# Altium schematic sheet Top.SchDoc
size B; SheetNumber: 1; SheetTotal: 7
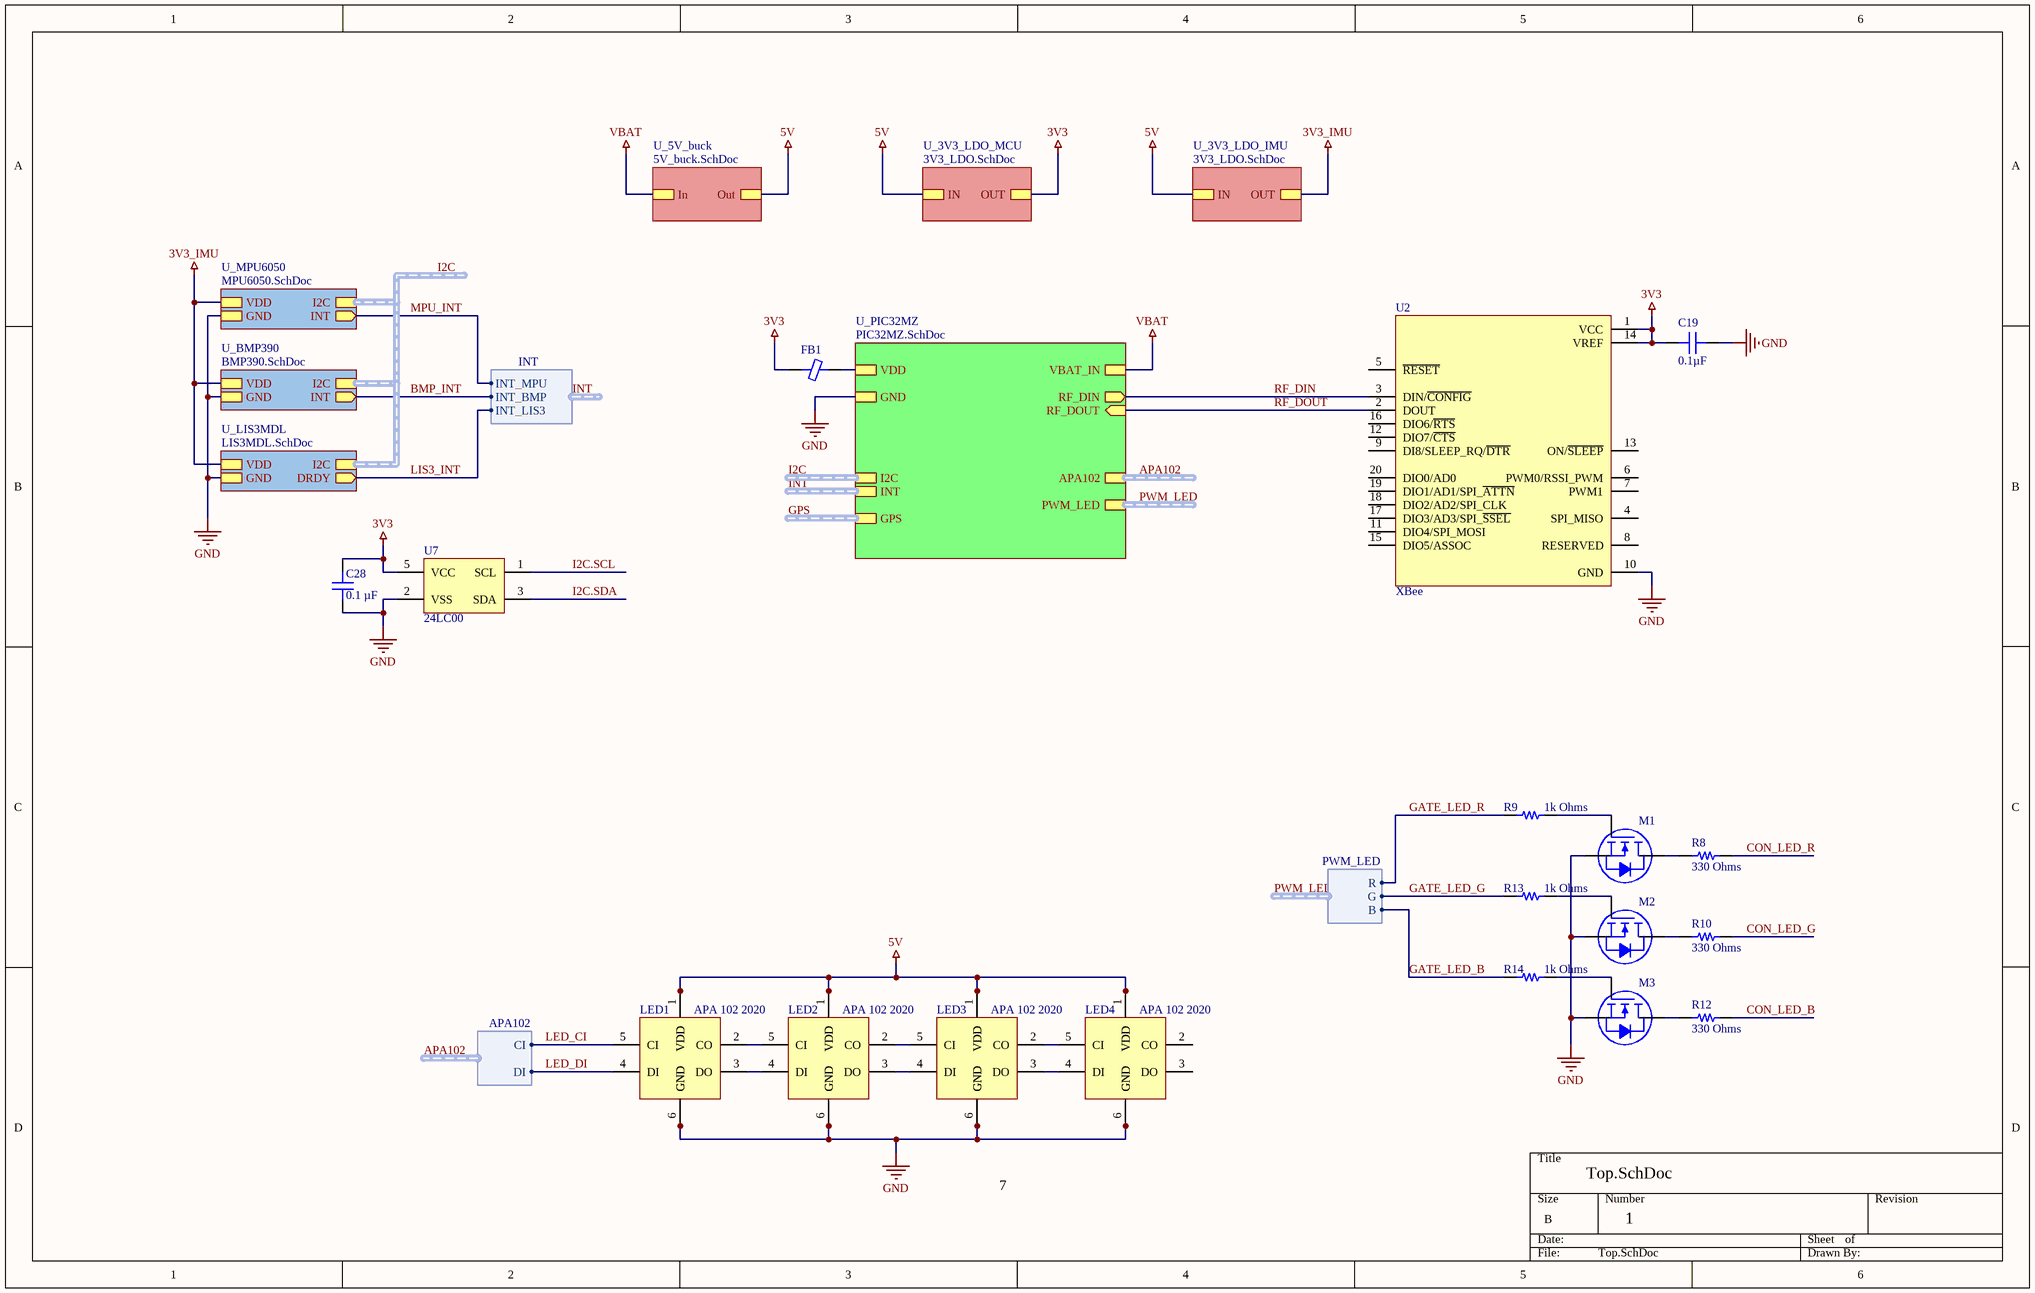
[diagram p0: Top.SchDoc]

## Parts
C19  0.1µF  [CAP 0603_1608]
C28  0.1 µF  [CAP 0402_1005]
FB1  (no value)  [FER 0805_2012]
LED1  APA 102 2020  [LED_APA-102-2020-256-8]
LED2  APA 102 2020  [LED_APA-102-2020-256-8]
LED3  APA 102 2020  [LED_APA-102-2020-256-8]
LED4  APA 102 2020  [LED_APA-102-2020-256-8]
M1  BSS123-7-F  [DIODES SOT-23-3]  (value not drawn)
M2  BSS123-7-F  [DIODES SOT-23-3]  (value not drawn)
M3  BSS123-7-F  [DIODES SOT-23-3]  (value not drawn)
R8  330 Ohms  [RES 0603_1608]
R9  1k Ohms  [RES 0402_1005]
R10  330 Ohms  [RES 0603_1608]
R12  330 Ohms  [RES 0603_1608]
R13  1k Ohms  [RES 0402_1005]
R14  1k Ohms  [RES 0402_1005]
U2  XBee  [XBee]
U7  24LC00  [SOT-23-5]

## Sub-sheets
U_3V3_LDO_IMU = 3V3_LDO.SchDoc: OUT, IN
U_3V3_LDO_MCU = 3V3_LDO.SchDoc: OUT, IN
U_5V_buck = 5V_buck.SchDoc: Out, In
U_BMP390 = BMP390.SchDoc: VDD, GND, I2C (harness I2C), INT (out)
U_LIS3MDL = LIS3MDL.SchDoc: VDD, GND, I2C (harness I2C), DRDY (out)
U_MPU6050 = MPU6050.SchDoc: VDD, GND, I2C (harness I2C), INT (out)
U_PIC32MZ = PIC32MZ.SchDoc: RF_DIN (out), RF_DOUT (in), GND, VDD, VBAT_IN, APA102 (harness APA102), I2C (harness I2C), GPS (harness GPS), PWM_LED (harness PWM_LED), INT (harness INT)

## Harnesses
APA102: DI, CI
PWM_LED: R, B, G
INT: INT_MPU, INT_BMP, INT_LIS3

## Nets
3V3: C19.1 C28.2 FB1.1 U2.1(VCC) U2.14(VREF) U7.5(VCC) ; sheet U_3V3_LDO_MCU/OUT
3V3_IMU: sheet U_3V3_LDO_IMU/OUT, sheet U_MPU6050/VDD, sheet U_BMP390/VDD, sheet U_LIS3MDL/VDD
5V: LED1.1(VDD) LED1.8(VDD) LED2.1(VDD) LED2.8(VDD) LED3.1(VDD) LED3.8(VDD) LED4.1(VDD) LED4.8(VDD) ; sheet U_3V3_LDO_MCU/IN, sheet U_3V3_LDO_IMU/IN, sheet U_5V_buck/Out
GND: C19.2 C28.1 LED1.6(GND) LED1.7(GND) LED2.6(GND) LED2.7(GND) LED3.6(GND) LED3.7(GND) LED4.6(GND) LED4.7(GND) M1.2(S) M2.2(S) M3.2(S) U2.10(GND) U7.2(VSS) ; sheet U_PIC32MZ/GND, sheet U_MPU6050/GND, sheet U_BMP390/GND, sheet U_LIS3MDL/GND
VBAT: sheet U_PIC32MZ/VBAT_IN, sheet U_5V_buck/In
BMP_INT: sheet U_BMP390/INT, sheet U_PIC32MZ/INT.INT_BMP
CON_LED_B: R12.2
CON_LED_G: R10.2
CON_LED_R: R8.2
GATE_LED_B: R14.2 ; sheet U_PIC32MZ/PWM_LED.B
GATE_LED_G: R13.2 ; sheet U_PIC32MZ/PWM_LED.G
GATE_LED_R: R9.2 ; sheet U_PIC32MZ/PWM_LED.R
I2C.SCL: U7.1(SCL)
I2C.SDA: U7.3(SDA)
LED_CI: LED1.5(CI) ; sheet U_PIC32MZ/APA102.CI  [project net APA102.CI]
LED_DI: LED1.4(DI) ; sheet U_PIC32MZ/APA102.DI  [project net APA102.DI]
LIS3_INT: sheet U_LIS3MDL/DRDY, sheet U_PIC32MZ/INT.INT_LIS3  [project net INT.INT_LIS3]
MPU_INT: sheet U_MPU6050/INT, sheet U_PIC32MZ/INT.INT_MPU  [project net INT.INT_MPU]
RF_DIN: U2.3(DIN/~{CONFIG}) ; sheet U_PIC32MZ/RF_DIN
RF_DOUT: U2.2(DOUT) ; sheet U_PIC32MZ/RF_DOUT
NetFB1_2: FB1.2 ; sheet U_PIC32MZ/VDD
NetLED1_2: LED1.2(CO) LED2.5(CI)
NetLED1_3: LED1.3(DO) LED2.4(DI)
NetLED2_2: LED2.2(CO) LED3.5(CI)
NetLED2_3: LED2.3(DO) LED3.4(DI)
NetLED3_2: LED3.2(CO) LED4.5(CI)
NetLED3_3: LED3.3(DO) LED4.4(DI)
NetM1_1: M1.1(G) R9.1
NetM1_3: M1.3(D) R8.1
NetM2_1: M2.1(G) R13.1
NetM2_3: M2.3(D) R10.1
NetM3_1: M3.1(G) R14.1
NetM3_3: M3.3(D) R12.1

Not connected (* = marked no-connect by the designer): LED4 2(CO) 3(DO); U2 4(SPI_MISO) 5(~{RESET}) 6(PWM0/RSSI_PWM) 7(PWM1) 8(RESERVED) 9(DI8/SLEEP_RQ/~{DTR}) 11(DIO4/SPI_MOSI) 12(DIO7/~{CTS}) 13(ON/~{SLEEP}) 15(DIO5/ASSOC) 16(DIO6/~{RTS}) 17(DIO3/AD3/SPI_~{SSEL}) 18(DIO2/AD2/SPI_CLK) 19(DIO1/AD1/SPI_~{ATTN}) 20(DIO0/AD0)

## Buses and harness runs
harness APA102 = sheet U_PIC32MZ/APA102
harness GPS = sheet U_PIC32MZ/GPS
harness I2C = sheet U_BMP390/I2C = sheet U_LIS3MDL/I2C = sheet U_MPU6050/I2C
harness I2C = sheet U_PIC32MZ/I2C
harness INT = sheet U_PIC32MZ/INT
harness PWM_LED = sheet U_PIC32MZ/PWM_LED

## Library data of the parts
C19 = LD035C104JAB2A: CAP CER 0.1UF 50V X7R 0603; manufacturer: AVX Corporation; Tolerance: ±5%; Part Number: LD035C104JAB2A; Value: 0.1µF; Applications: General Purpose; Capacitance: 0.1µF; componentlink1description: Datasheet; componentlink1url: http://datasheets.avx.com/LD-Series.pdf; componentlink2description: DigiKey Link; componentlink2url: http://digikey.com/product-detail/en/avx-corporation/LD035C104JAB2A/478-13106-1-ND/9948622; Device Package: 0603 (1608 Metric); lastupdated: 9/2/2020 1:03:21 AM; Lifecycle Status: Active; Minimum Order: 1; Mounting Type: Surface Mount, MLCC; Operating Temperature: -55°C ~ 125°C; Package / Case: 0603 (1608 Metric); packaging: TapeAndReel; partid: 10760; Part Status: Active; price: 0.23; series: LD; Size / Dimension: 0.063" L x 0.032" W (1.60mm x 0.81mm); Supplier 1: DigiKey; Supplier Part Number 1: 478-13106-1-ND; Temperature Coefficient: X7R; Thickness (Max): 0.035" (0.90mm); Voltage - Rated: 50V
C28 = C0402C104K4RACAUTO: CAP CER 0.1UF 16V X7R 0402; manufacturer: KEMET; Tolerance: ±10%; Part Number: C0402C104K4RACAUTO; Value: 0.1 µF; Applications: Automotive, Bypass, Decoupling; Capacitance: 0.1 µF; componentlink1description: Datasheet; componentlink1url: https://api.kemet.com/component-edge/download/specsheet/C0402C104K4RACAUTO.pdf; componentlink2description: DigiKey Link; componentlink2url: https://www.digikey.com/en/products/detail/kemet/C0402C104K4RACAUTO/3314827; Device Package: 0402 (1005 Metric); lastupdated: 8/14/2022 9:05:51 PM; Lifecycle Status: Active; Minimum Order: 1; Mounting Type: Surface Mount, MLCC; Operating Temperature: -55°C ~ 125°C; Package / Case: 0402 (1005 Metric); packaging: TapeAndReel; partid: 3024; Part Status: Active; price: 0.01; Ratings: AEC-Q200; series: SMD Auto X7R; Size / Dimension: 0.039" L x 0.020" W (1.00mm x 0.50mm); Supplier 1: DigiKey; Supplier Part Number 1: 399-6828-1-ND; Temperature Coefficient: X7R; Thickness (Max): 0.022" (0.55mm); Voltage - Rated: 16V
FB1 = 2508051017Y0: FERRITE BEAD 0805 1LN; Manufacturer: Fair-Rite Products Corp.; Current Rating (Max): 300mA; DC Resistance (DCR) (Max): 200mOhm; Filter Type: Signal Line; Number of Lines: 1; Part Number: 2508051017Y0; ComponentLink1Description: Datasheet; ComponentLink1URL: http://www.fair-rite.com/wp-content/themes/fair-rite/print_product.php?pid=19091; ComponentLink2Description: DigiKey Link; ComponentLink2URL: http://digikey.com/product-detail/en/fair-rite-products-corp/2508051017Y0/1934-1435-1-ND/8594382; Device Package: 0805 (2012 Metric); Height (Max): 0.043" (1.10mm); LastUpdated: 9/2/2020 1:18:22 AM; Lifecycle Status: Active; Minimum Order: 1; Mounting Type: Surface Mount; Operating Temperature: -55°C ~ 125°C; Package / Case: 0805 (2012 Metric); Packaging: TapeAndReel; PartId: 1308; Part Status: Active; Price: 0.02; Series: -; Size / Dimension: 0.079" L x 0.049" W (2.00mm x 1.25mm); Supplier 1: DigiKey; Supplier Part Number 1: 1934-1435-1-ND
LED1-LED4 = APA-102-2020-256-8: 8-pin type LED three-color RGB Dimming control; MF: iPixel LED Light Co.; MP: APA-102-2020-256-8; Value: *; SnapEDA_Link: https://www.snapeda.com/parts/APA-102-2020-256-8/iPixel%20LED%20Light%20Co./view-part/698331/?ref=snap; Availability: Unavailable; Package: SMD-8 iPixel LED Light Co.; Price: None
M1-M3 = BSS123-7-F: MOSFET N-CH 100V 170MA SOT23-3; Manufacturer: Diodes Incorporated; Current - Continuous Drain (Id) @ 25°C: 170mA (Ta); Drive Voltage (Max Rds On,  Min Rds On): 10V; FET Type: N-Channel; Input Capacitance (Ciss) (Max) @ Vds: 60pF @ 25V; Power Dissipation (Max): 300mW (Ta); Rds On (Max) @ Id, Vgs: 6Ohm @ 170mA, 10V; Vgs (Max): ±20V; Vgs(th) (Max) @ Id: 2V @ 1mA; Part Number: BSS123-7-F; ComponentLink1Description: Datasheet; ComponentLink1URL: https://www.diodes.com/assets/Datasheets/ds30366.pdf; ComponentLink2Description: DigiKey Link; ComponentLink2URL: http://digikey.com/product-detail/en/diodes-incorporated/BSS123-7-F/BSS123-FDICT-ND/717842; Drain to Source Voltage (Vdss): 100V; LastUpdated: 8/14/2022 10:06:21 PM; Lifecycle Status: Active; Minimum Order: 1; Mounting Type: Surface Mount; Operating Temperature: -55°C ~ 150°C (TJ); Package / Case: TO-236-3, SC-59, SOT-23-3; Packaging: TapeAndReel; Part Status: Active; Price: 0.05; Series: -; Supplier 1: DigiKey; Supplier Part Number 1: BSS123-FDICT-ND; Supplier Device Package: SOT-23-3; Technology: MOSFET (Metal Oxide)
R8 R10 R12 = RNCS0603BKE10K0: RES 10K OHM 0.1% 1/16W 0603; Manufacturer: Stackpole Electronics Inc; Power (Watts): 0.063W, 1/16W; Resistance: 10 kOhms; Temperature Coefficient: ±25ppm/°C; Part Number: RNCS0603BKE10K0; Value: 330 Ohms; ComponentLink1Description: Datasheet; ComponentLink1URL: https://www.seielect.com/catalog/sei-rncs_rnch.pdf; ComponentLink2Description: DigiKey Link; ComponentLink2URL: https://www.digikey.com/en/products/detail/stackpole-electronics-inc/RNCS0603BKE10K0/1708836; Composition: Thin Film; Device Package: 0603 (1608 Metric); Features: Anti-Corrosive, Automotive AEC-Q200, Moisture Resistant; Height - Seated (Max): 0.022" (0.55mm); LastUpdated: 8/14/2022 9:31:27 PM; Lifecycle Status: Active; Minimum Order: 1; Number of Terminations: 2; Operating Temperature: -55°C ~ 155°C; Package / Case: 0603 (1608 Metric); Packaging: TapeAndReel; PartId: 4838; Part Status: Active; Price: 0.08; Ratings: AEC-Q200; Series: RNCS; Size / Dimension: 0.061" L x 0.031" W (1.55mm x 0.80mm); Supplier 1: DigiKey; Supplier Part Number 1: RNCS0603BKE10K0CT-ND; Supplier Device Package: 0603; Tolerance: ±0.1%
R9 R13 R14 = CRCW0402330RJNEDC: RES 330 OHM 5% 1/16W 0402; Manufacturer: Vishay Dale; Power (Watts): 0.063W, 1/16W; Resistance: 330 Ohms; Temperature Coefficient: ±200ppm/°C; Part Number: CRCW0402330RJNEDC; Value: 1k Ohms; ComponentLink1Description: Datasheet; ComponentLink1URL: http://www.vishay.com/docs/28773/crcwce3.pdf; ComponentLink2Description: DigiKey Link; ComponentLink2URL: https://www.digikey.com/en/products/detail/vishay-dale/CRCW0402330RJNEDC/7928545; Composition: Thick Film; Device Package: 0402 (1005 Metric); Height - Seated (Max): 0.014" (0.35mm); LastUpdated: 8/14/2022 9:23:31 PM; Lifecycle Status: Active; Minimum Order: 1; Number of Terminations: 2; Operating Temperature: -55°C ~ 155°C; Package / Case: 0402 (1005 Metric); Packaging: CutTape; PartId: 15989; Part Status: Active; Price: 0.01; Series: CRCW-C; Size / Dimension: 0.039" L x 0.020" W (1.00mm x 0.50mm); Supplier 1: DigiKey; Supplier Part Number 1: 541-4123-1-ND; Supplier Device Package: 0402; Tolerance: ±5%
U2 = XBee: 802.15.4 Transceiver Module 2.4GHz Antenna Not Included, U.FL Through Hole
U7 = 24LC00: EEPROM